# EAGLE design MCP23S17-v2 (EAGLE 9.6.2)
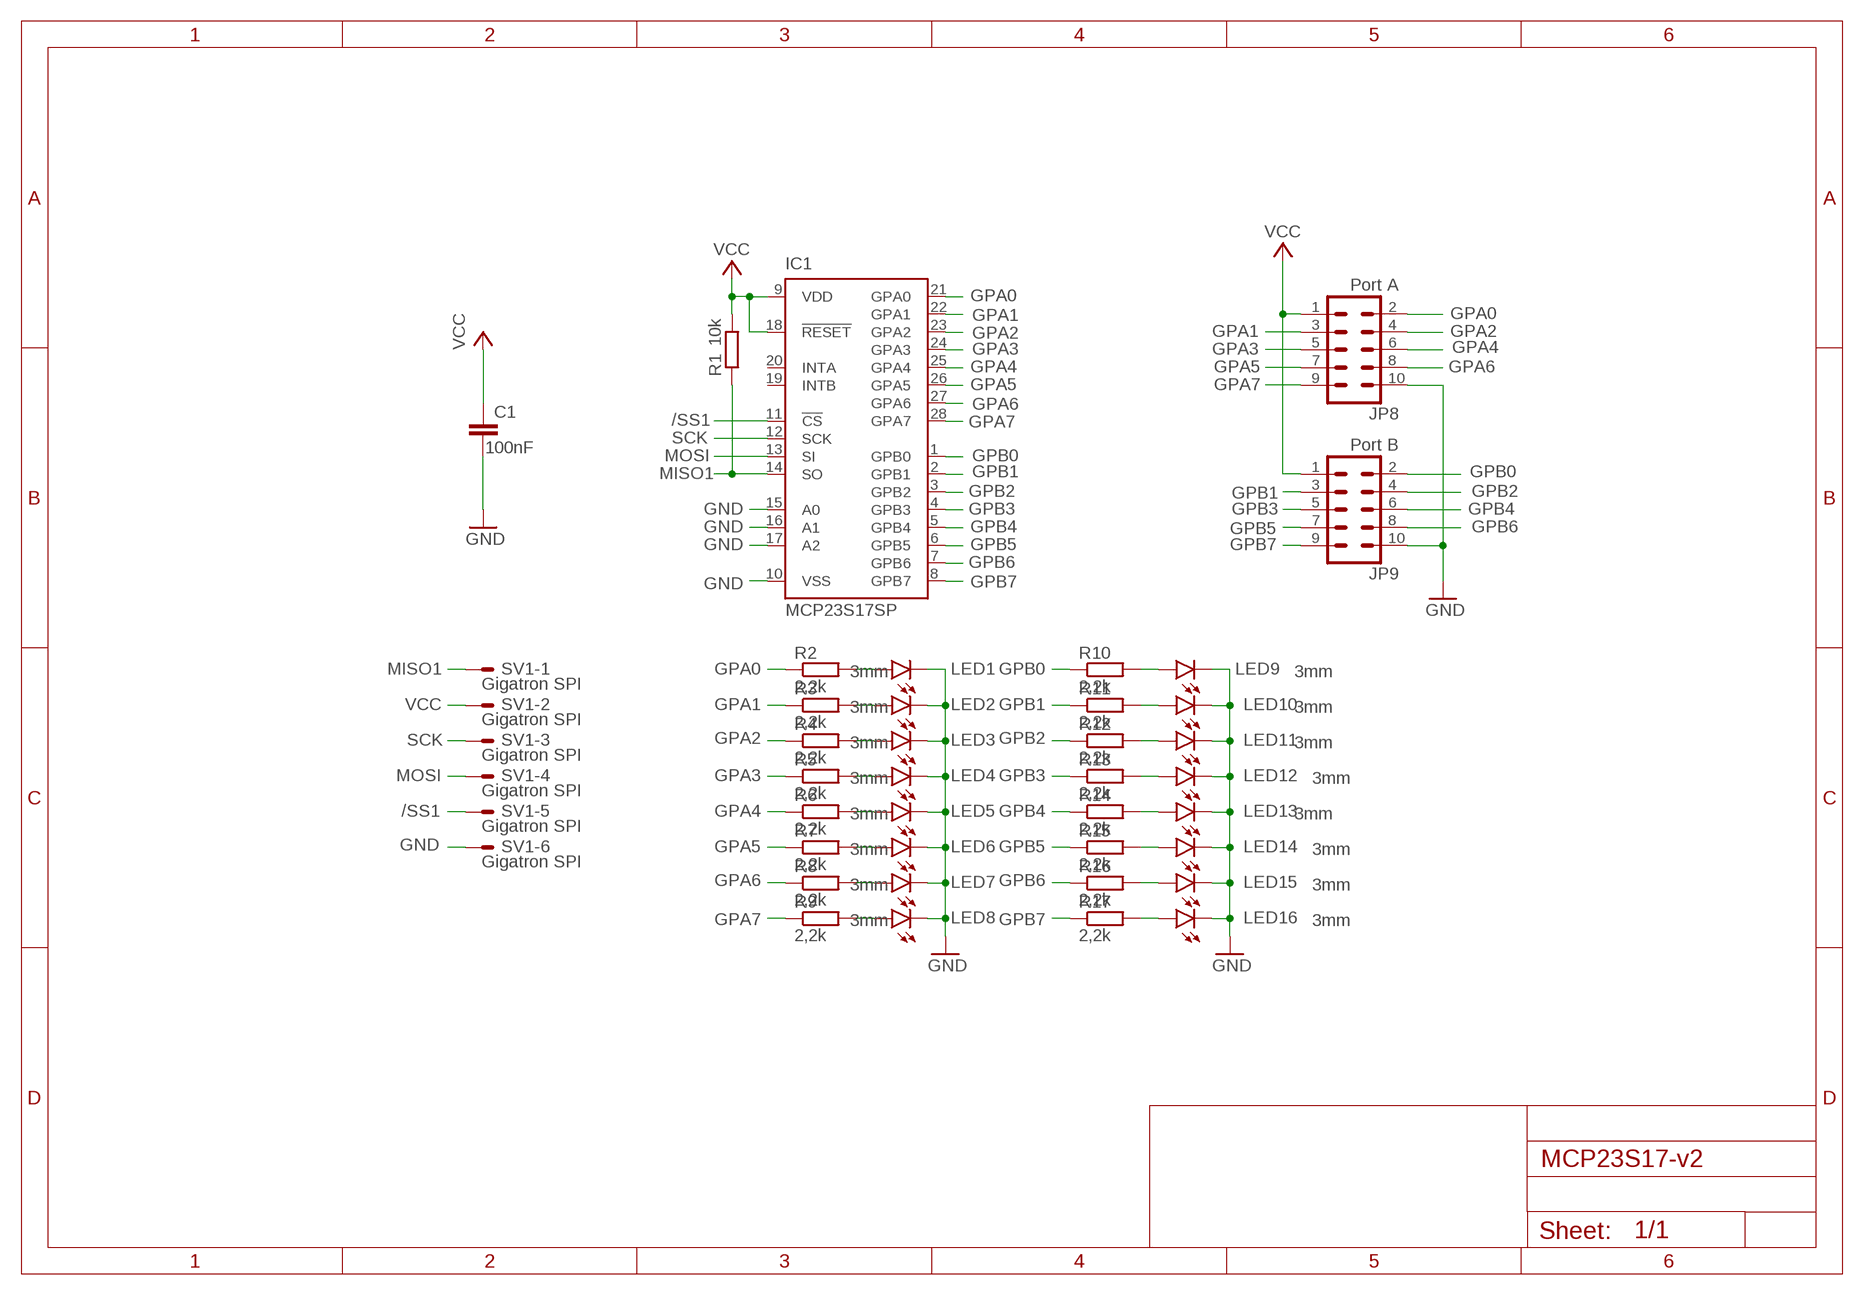
[diagram p0: schematic, sheet 1]

## Parts
C1  100nF  C5/2.5  [C5B2.5]
IC1  MCP23S17SP  [DIL28-3]
JP8  Port A  ML10  [ML10]
JP9  Port B  ML10  [ML10]
LED1  3mm  LED3MM  [LED3MM]
LED2  3mm  LED3MM  [LED3MM]
LED3  3mm  LED3MM  [LED3MM]
LED4  3mm  LED3MM  [LED3MM]
LED5  3mm  LED3MM  [LED3MM]
LED6  3mm  LED3MM  [LED3MM]
LED7  3mm  LED3MM  [LED3MM]
LED8  3mm  LED3MM  [LED3MM]
LED9  3mm  LED3MM  [LED3MM]
LED10  3mm  LED3MM  [LED3MM]
LED11  3mm  LED3MM  [LED3MM]
LED12  3mm  LED3MM  [LED3MM]
LED13  3mm  LED3MM  [LED3MM]
LED14  3mm  LED3MM  [LED3MM]
LED15  3mm  LED3MM  [LED3MM]
LED16  3mm  LED3MM  [LED3MM]
R1  10k  R-EU_0207/10  [0207/10]
R2  2,2k  R-EU_0207/10  [0207/10]
R3  2,2k  R-EU_0207/10  [0207/10]
R4  2,2k  R-EU_0207/10  [0207/10]
R5  2,2k  R-EU_0207/10  [0207/10]
R6  2,2k  R-EU_0207/10  [0207/10]
R7  2,2k  R-EU_0207/10  [0207/10]
R8  2,2k  R-EU_0207/10  [0207/10]
R9  2,2k  R-EU_0207/10  [0207/10]
R10  2,2k  R-EU_0207/10  [0207/10]
R11  2,2k  R-EU_0207/10  [0207/10]
R12  2,2k  R-EU_0207/10  [0207/10]
R13  2,2k  R-EU_0207/10  [0207/10]
R14  2,2k  R-EU_0207/10  [0207/10]
R15  2,2k  R-EU_0207/10  [0207/10]
R16  2,2k  R-EU_0207/10  [0207/10]
R17  2,2k  R-EU_0207/10  [0207/10]
SV1  Gigatron SPI  ML6E  [ML6]

## Nets
/SS1: IC1.11(!CS) SV1.5
GND [power]: C1.2 IC1.10(VSS) IC1.15(A0) IC1.16(A1) IC1.17(A2) JP8.10 JP9.10 LED1.K(C) LED2.K(C) LED3.K(C) LED4.K(C) LED5.K(C) LED6.K(C) LED7.K(C) LED8.K(C) LED9.K(C) LED10.K(C) LED11.K(C) LED12.K(C) LED13.K(C) LED14.K(C) LED15.K(C) LED16.K(C) SV1.6
GPA0: IC1.21(GPA0) JP8.2 R2.1
GPA1: IC1.22(GPA1) JP8.3 R3.1
GPA2: IC1.23(GPA2) JP8.4 R4.1
GPA3: IC1.24(GPA3) JP8.5 R5.1
GPA4: IC1.25(GPA4) JP8.6 R6.1
GPA5: IC1.26(GPA5) JP8.7 R7.1
GPA6: IC1.27(GPA6) JP8.8 R8.1
GPA7: IC1.28(GPA7) JP8.9 R9.1
GPB0: IC1.1(GPB0) JP9.2 R10.1
GPB1: IC1.2(GPB1) JP9.3 R11.1
GPB2: IC1.3(GPB2) JP9.4 R12.1
GPB3: IC1.4(GPB3) JP9.5 R13.1
GPB4: IC1.5(GPB4) JP9.6 R14.1
GPB5: IC1.6(GPB5) JP9.7 R15.1
GPB6: IC1.7(GPB6) JP9.8 R16.1
GPB7: IC1.8(GPB7) JP9.9 R17.1
MISO1: IC1.14(SO) R1.1 SV1.1
MOSI: IC1.13(SI) SV1.4
N$1: LED1.A R2.2
N$2: LED2.A R3.2
N$3: LED3.A R4.2
N$4: LED4.A R5.2
N$5: LED5.A R6.2
N$6: LED6.A R7.2
N$7: LED7.A R8.2
N$8: LED8.A R9.2
N$9: LED9.A R10.2
N$10: LED10.A R11.2
N$11: LED11.A R12.2
N$12: LED12.A R13.2
N$13: LED13.A R14.2
N$14: LED14.A R15.2
N$15: LED15.A R16.2
N$16: LED16.A R17.2
SCK: IC1.12(SCK) SV1.3
VCC [power]: C1.1 IC1.9(VDD) IC1.18(!RESET) JP8.1 JP9.1 R1.2 SV1.2
Unconnected: IC1.19(INTB) IC1.20(INTA)

## Library data of the parts
C1 = capacitor-wima:C: CAPACITOR naming: grid - package width
IC1 = microchip:MCP23S17: http://ww1.microchip.com/downloads/en/DeviceDoc/21952a.pdf Source: http://ww1.microchip.com/downloads/en/DeviceDoc/21952a.pdf; MF: MICROCHIP; MPN: MCP23S17-E/SP; OC_FARNELL: 1292238; OC_NEWARK: 31K2951
JP8 JP9 = con-ml:ML10: HARTING; OC_FARNELL: unknown; OC_NEWARK: unknown
LED1-LED16 = led:LED: LED OSRAM: - CHIPLED LG R971, LG N971, LY N971, LG Q971, LY Q971, LO R971, LY R971 LH N974, LH R974 LS Q976, LO Q976, LY Q976 LO Q996 - Hyper CHIPLED LW Q18S LB Q993, LB Q99A, LB R99A - SideLED LS A670, LO A670, LY A670, LG A670, LP A670 LB A673, LV A673, LT A673, LW A673 LH A674 LY A675 LS A676, LA A676, LO A676, LY A676, LW A676 LS A679, LY A679, LG A679 - Hyper Micro SIDELED® LS Y876, LA Y876, LO Y876, LY Y876 LT Y87S - SmartLED LW L88C, LW L88S LB L89C, LB L89S, LG L890 LS L89K, LO L89K, LY L89K LS L896, LA L896, LO L896, LY L896 - TOPLED LS T670, LO T670, LY T670, LG T670, LP T670 LSG T670, LSP T670, LSY T670, LOP T670, LYG T670 LG T671, LOG T671, LSG T671 LB T673, LV T673, LT T673, LW T673 LH T674 LS T676, LA T676, LO T676, LY T676, LB T676, LH T676, LSB T676, LW T676 LB T67C, LV T67C, LT T67C, LS T67K, LO T67K, LY T67K, LW E67C LS E67B, LA E67B, LO E67B, LY E67B, LB E67C, LV E67C, LT E67C LW T67C LS T679, LY T679, LG T679 LS T770, LO T770, LY T770, LG T770, LP T770 LB T773, LV T773, LT T773, LW T773 LH T774 LS E675, LA E675, LY E675, LS T675 LS T776, LA T776, LO T776, LY T776, LB T776 LHGB T686 LT T68C, LB T68C - Hyper Mini TOPLED® LB M676 - Mini TOPLED Santana® LG M470 LS M47K, LO M47K, LY M47K Source: http://www.osram.convergy.de LUXEON: - LUMILED® LXK2-PW12-R00, LXK2-PW12-S00, LXK2-PW14-U00, LXK2-PW14-V00 LXK2-PM12-R00, LXK2-PM12-S00, LXK2-PM14-U00 LXK2-PE12-Q00, LXK2-PE12-R00, LXK2-PE12-S00, LXK2-PE14-T00, LXK2-PE14-U00 LXK2-PB12-K00, LXK2-PB12-L00, LXK2-PB12-M00, LXK2-PB14-N00, LXK2-PB14-P00, LXK2-PB14-Q00 LXK2-PR12-L00, LXK2-PR12-M00, LXK2-PR14-Q00, LXK2-PR14-R00 LXK2-PD12-Q00, LXK2-PD12-R00, LXK2-PD12-S00 LXK2-PH12-R00, LXK2-PH12-S00 LXK2-PL12-P00, LXK2-PL12-Q00, LXK2-PL12-R00 Source: www.luxeon.com KINGBRIGHT: KA-3528ASYC Source: www.kingbright.com
R1-R17 = rcl:R-EU_: RESISTOR, European symbol; SPICEPREFIX: R
SV1 = con-ml:ML6E: HARTING; OC_FARNELL: unknown; OC_NEWARK: unknown

## Net classes
0 default: width 0.203 mm, drill 0.127 mm, clearance 0.203 mm
1 power: width 0.254 mm, drill 0.127 mm, clearance 0.203 mm

## Board
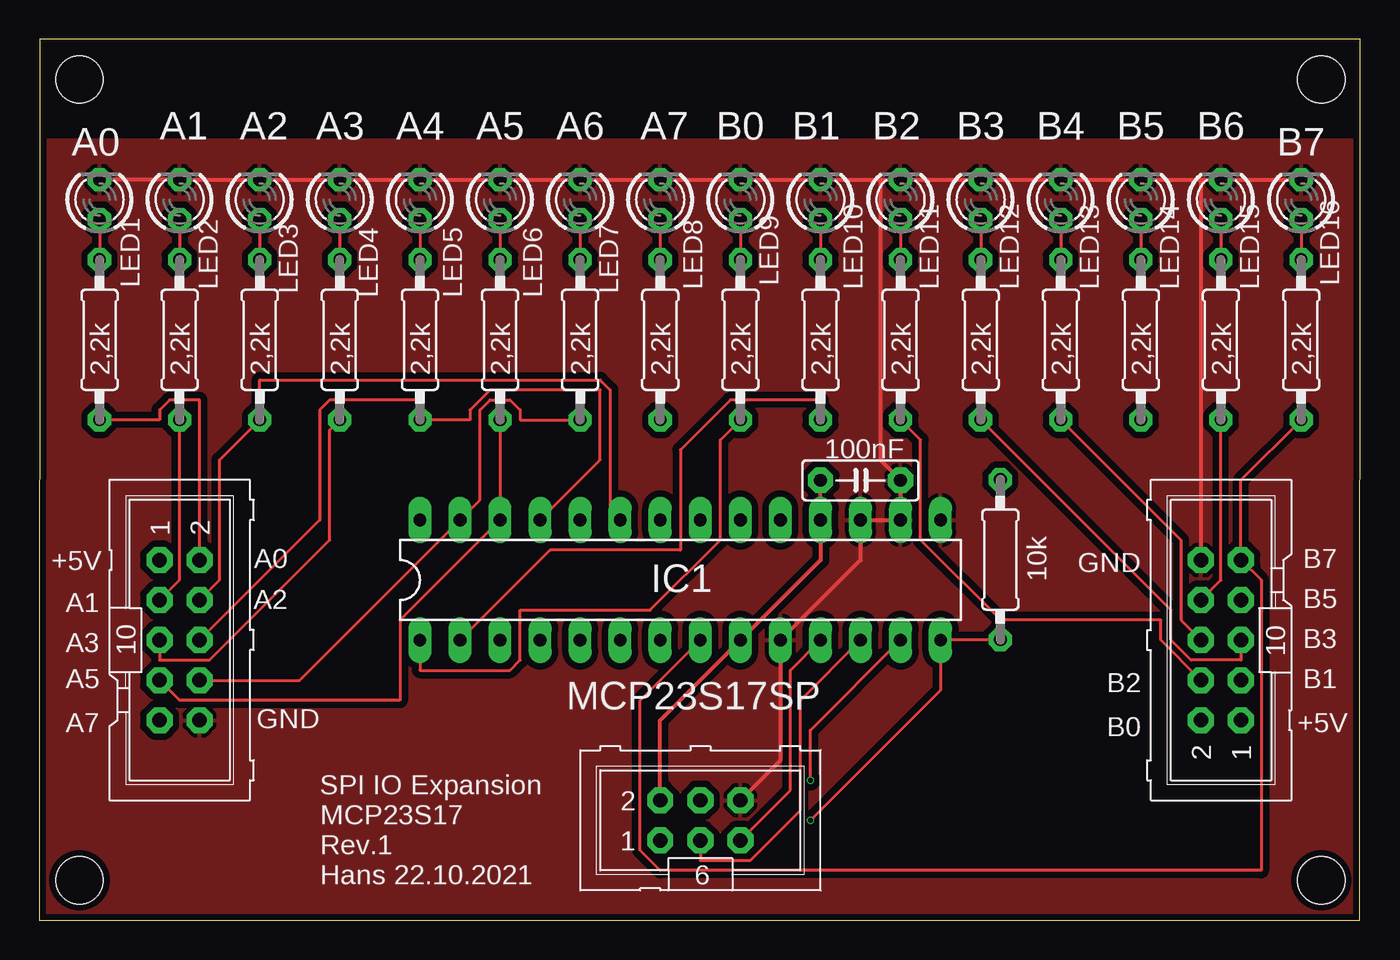
[diagram p1: board, top side]
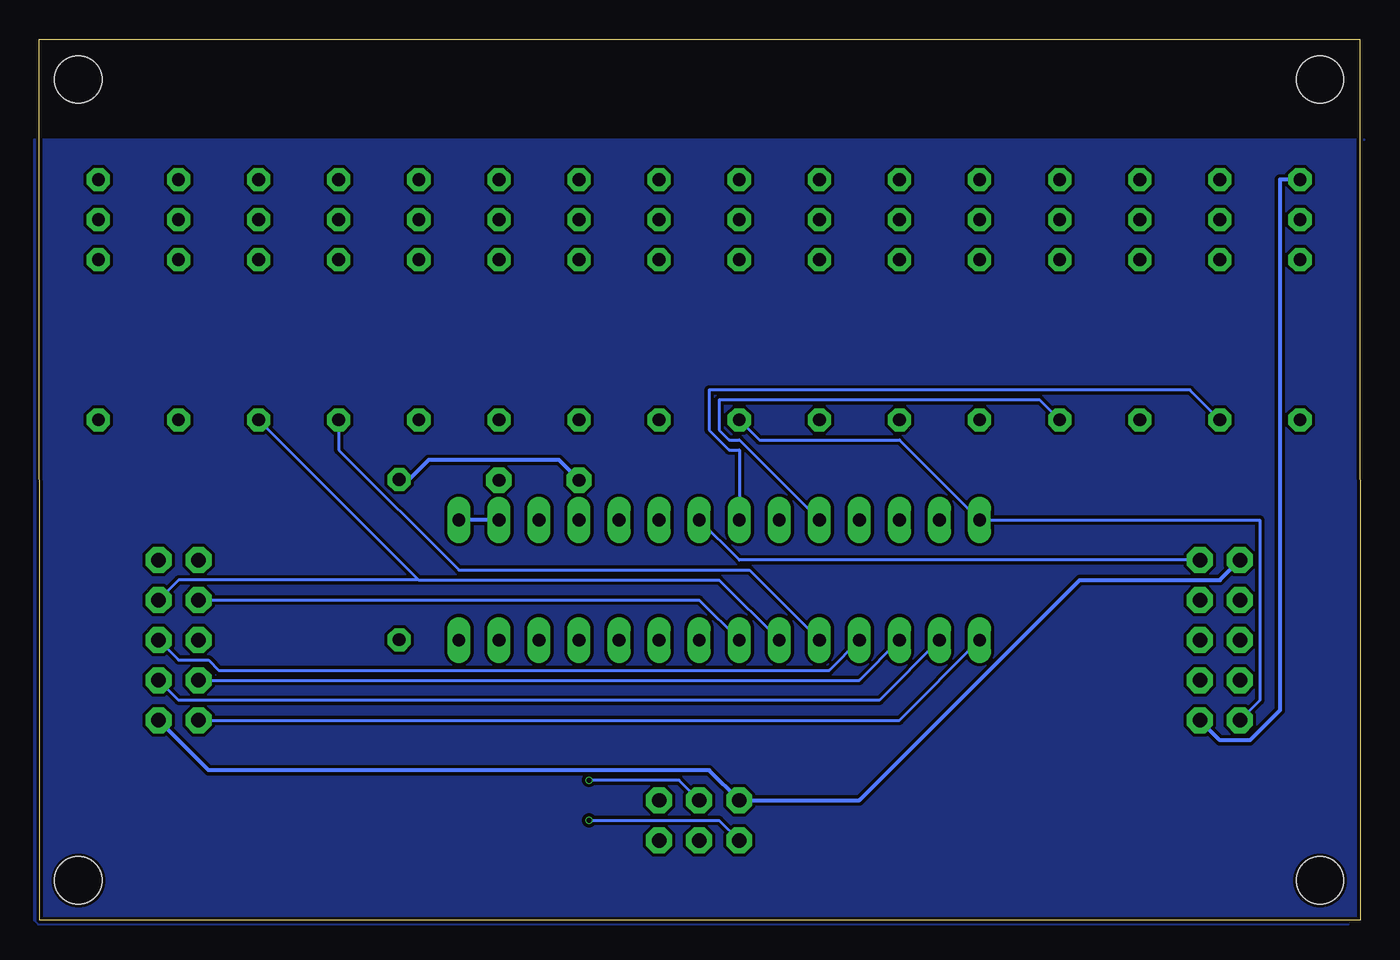
[diagram p2: board, bottom side, seen from below]

Size 83.75 x 55.88 mm. Coordinates in mm from the lower left corner, seen from the top.
Outline: 0,0 83.72,0 83.75,55.88 0.03,55.88 0,0
Copper layers (1*16): Top 0.035mm / dielectric 1.6mm / Bottom 0.035mm
Design rules "jlcpcb-2layers": minimum track width 5mil, minimum drill 0.3mm, track to track 5mil, track to pad 5mil, pad to pad 5mil, via to via 5mil, smd to smd 5mil, copper to edge 0.2mm, drill to drill 6mil, minimum pad ring 10mil, minimum via ring 3mil, stop-mask expansion 4mil, vias tented up to drill 0mil, thermal gap 10mil
Holes 3 mm at 2.54,2.54 81.28,2.54 2.54,53.34 81.28,53.34

### Footprints (pad centres in the part's own frame; a part is rotated, then mirrored left to right if it is on the bottom)
C5B2.5 = drill 0.813 pad 1.6 octagon: 1 -2.54,0; 2 2.54,0
DIL28-3 = drill 0.813 long: 1 -16.51,-3.81; 2 -13.97,-3.81; 3 -11.43,-3.81; 4 -8.89,-3.81; 5 -6.35,-3.81; 6 -3.81,-3.81; 7 -1.27,-3.81; 8 1.27,-3.81; 9 3.81,-3.81; 10 6.35,-3.81; 11 8.89,-3.81; 12 11.43,-3.81; 13 13.97,-3.81; 14 16.51,-3.81; 15 16.51,3.81; 16 13.97,3.81; 17 11.43,3.81; 18 8.89,3.81; 19 6.35,3.81; 20 3.81,3.81; 21 1.27,3.81; 22 -1.27,3.81; 23 -3.81,3.81; 24 -6.35,3.81; 25 -8.89,3.81; 26 -11.43,3.81; 27 -13.97,3.81; 28 -16.51,3.81
ML10 = drill 0.914 octagon: 1 -5.08,-1.27; 2 -5.08,1.27; 3 -2.54,-1.27; 4 -2.54,1.27; 5 0,-1.27; 6 0,1.27; 7 2.54,-1.27; 8 2.54,1.27; 9 5.08,-1.27; 10 5.08,1.27
LED3MM = drill 0.813 octagon: A -1.27,0; K 1.27,0
0207/10 = drill 0.813 octagon: 1 -5.08,0; 2 5.08,0
ML6 = drill 0.914 octagon: 1 -2.54,-1.27; 2 -2.54,1.27; 3 0,-1.27; 4 0,1.27; 5 2.54,-1.27; 6 2.54,1.27

### Placement (x,y rotation side)
C1  52.07,27.91 0 top
IC1  40.64,21.59 0 top
JP8  8.89,17.78 270 top
JP9  74.93,17.78 90 top
LED1  3.81,45.72 90 top
LED2  8.89,45.72 90 top
LED3  13.97,45.72 90 top
LED4  19.05,45.72 90 top
LED5  24.13,45.72 90 top
LED6  29.21,45.72 90 top
LED7  34.29,45.72 90 top
LED8  39.37,45.72 90 top
LED9  44.45,45.72 90 top
LED10  49.53,45.72 90 top
LED11  54.61,45.72 90 top
LED12  59.69,45.72 90 top
LED13  64.77,45.72 90 top
LED14  69.85,45.72 90 top
LED15  74.93,45.72 90 top
LED16  80.01,45.72 90 top
R1  60.93,22.89 90 top
R2  3.81,36.83 90 top
R3  8.89,36.83 90 top
R4  13.97,36.83 90 top
R5  19.05,36.83 90 top
R6  24.13,36.83 90 top
R7  29.21,36.83 90 top
R8  34.29,36.83 90 top
R9  39.37,36.83 90 top
R10  44.45,36.83 90 top
R11  49.53,36.83 90 top
R12  54.61,36.83 90 top
R13  59.69,36.83 90 top
R14  64.77,36.83 90 top
R15  69.85,36.83 90 top
R16  74.93,36.83 90 top
R17  80.01,36.83 90 top
SV1  41.91,6.35 0 top

### Tracks (layer width: path | path; a pad name or v marks a point on that pad's centre or on a via)
/SS1
  Top 0.203: IC1.11 47.62,15.88 47.62,8.26 SV1.5
GND
  Top 0.254: SV1.6 46.99,10.16 IC1.10 52.07,22.86 IC1.17 IC1.16 C1.2 54.61,27.94 53.34,29.21 53.34,46.99 | LED1.K LED2.K LED3.K LED4.K LED5.K LED6.K LED7.K LED8.K LED9.K LED10.K 53.34,46.99 | 53.34,46.99 LED11.K LED12.K LED13.K LED14.K 73.66,46.99 | 73.66,46.99 LED15.K LED16.K | 73.66,46.99 JP9.10
  Bottom 0.254: IC1.16 IC1.15 | JP8.10 8.89,11.43 6.99,11.43 5.08,13.34 5.08,46.99 LED1.K
  pour Top (isolate 0.406): 0.51,0 0.25,-0.25 0.25,49.53 84.07,49.53 83.82,0
GPA0
  Top 0.203: R2.1 7.62,31.75 7.62,32.38 8.26,33.02 10.16,33.02 JP8.2
  Bottom 0.203: IC1.21 39.37,22.86 JP8.2
GPA1
  Top 0.203: R3.1 8.89,21.59 JP8.3
  Bottom 0.203: IC1.22 39.37,29.84 40.01,29.84 41.27,31.11 41.27,33.66 10.79,33.66 R3.1
GPA2
  Top 0.203: JP8.4 11.43,21.59 11.43,29.21 R4.1 13.97,34.29 35.56,34.29 36.2,33.66 36.2,26.04 IC1.23
GPA3
  Top 0.203: R5.1 18.41,31.11 18.41,24.13 10.79,16.51 7.62,16.51 JP8.5
  Bottom 0.203: IC1.24 39.37,30.48 40.01,30.48 40.64,31.11 40.64,33.02 20.32,33.02 R5.1
GPA4
  Top 0.203: IC1.25 35.56,29.21 35.56,33.66 28.57,33.66 27.3,32.38 27.3,31.75 R6.1 24.13,33.02 18.41,33.02 17.78,32.38 17.78,25.4 JP8.6
GPA5
  Top 0.203: R7.1 IC1.26 22.86,19.05 22.86,13.97 8.89,13.97 JP8.7
GPA6
  Top 0.203: JP8.8 16.51,15.24 IC1.27 27.94,26.67 27.94,32.38 28.57,33.02 29.84,33.02 30.48,32.38 30.48,31.75 R8.1
GPA7
  Bottom 0.203: R9.1 38.1,30.48 29.21,30.48 IC1.28 6.35,25.4 6.35,13.97 JP8.9
GPB0
  Top 0.203: R10.1 43.18,30.48 43.18,24.13 38.73,19.68 30.48,19.68 30.48,16.51 29.84,15.88 24.13,15.88 IC1.1
  Bottom 0.203: IC1.1 29.21,12.7 JP9.2
GPB1
  Top 0.203: IC1.2 32.38,23.5 40.64,23.5 40.64,29.84 43.81,33.02 49.53,33.02 R11.1
  Bottom 0.203: JP9.3 74.93,13.97 30.48,13.97 IC1.2
GPB2
  Top 0.203: R12.1 55.88,30.48 55.88,24.13 60.96,19.05 71.12,19.05 71.12,17.78 JP9.4
  Bottom 0.203: IC1.3 31.75,15.24 JP9.4
GPB3
  Top 0.203: R13.1 71.75,19.68 71.75,17.78 73.03,16.51 76.2,16.51 JP9.5
  Bottom 0.203: IC1.4 33.66,15.88 72.39,15.88 73.03,16.51 74.93,16.51 JP9.5
GPB4
  Top 0.203: JP9.6 72.39,19.05 72.39,24.13 R14.1
  Bottom 0.203: IC1.5 38.73,22.23 57.15,22.23 64.77,29.84 R14.1
GPB5
  Bottom 0.203: IC1.6 40.64,21.59 59.69,21.59 | R15.1 59.69,21.59 | JP9.7 74.93,21.59 59.69,21.59
GPB6
  Top 0.203: R16.1 74.93,21.59 JP9.8
  Bottom 0.203: IC1.7 41.91,20.32 JP9.8
GPB7
  Top 0.203: IC1.8 38.1,13.97 38.1,4.45 39.37,3.17 77.47,3.17 77.47,21.59 JP9.9 76.2,27.94 R17.1
MISO1  (via drill 0.3)
  Top 0.203: R1.1 60.33,17.78 IC1.14 57.15,14.61 v48.9,6.35
  Bottom 0.203: SV1.1 40.64,6.35 v48.9,6.35
MOSI  (via drill 0.3)
  Top 0.203: IC1.13 48.9,12.06 v48.9,8.89
  Bottom 0.203: v48.9,8.89 43.18,8.89 SV1.4
N$1
  Top 0.203: LED1.A R2.2
N$2
  Top 0.203: LED2.A R3.2
N$3
  Top 0.203: LED3.A R4.2
N$4
  Top 0.203: LED4.A R5.2
N$5
  Top 0.203: LED5.A R6.2
N$6
  Top 0.203: LED6.A R7.2
N$7
  Top 0.203: LED7.A R8.2
N$8
  Top 0.203: LED8.A R9.2
N$9
  Top 0.203: LED9.A R10.2
N$10
  Top 0.203: LED10.A R11.2
N$11
  Top 0.203: LED11.A R12.2
N$12
  Top 0.203: LED12.A R13.2
N$13
  Top 0.203: LED13.A R14.2
N$14
  Top 0.203: LED14.A R15.2
N$15
  Top 0.203: LED15.A R16.2
N$16
  Top 0.203: LED16.A R17.2
N$17
  pour Bottom: 83.82,-0.25 0.76,-0.25 0.25,0.25 0.25,49.02 -0.25,49.53 84.07,49.53 84.07,0
SCK
  Top 0.203: IC1.12 48.26,13.97 48.26,6.99 45.09,3.81 41.91,3.81 SV1.3
VCC
  Top 0.254: C1.1 IC1.18 49.53,22.86 IC1.9 39.37,12.7 SV1.2
  Bottom 0.254: R1.2 60.33,27.94 59.05,29.21 50.8,29.21 49.53,27.94 C1.1 | JP8.1 8.89,21.59 17.78,21.59 31.75,7.62 SV1.2 41.27,9.53 73.03,9.53 JP9.1

### Text on the board
tPlace: A1 | A2 | A3 | A4 | A5 | A6 | A7 | B0 | B1 | B2 | B3 | B4 | B5 | B6 | A0 | B7 | A0 | B7 | +5V | GND | A1 | A2 | B5 | B3 | A3 | A5 | B2 | B1 | A7 | GND | B0 | +5V | SPI IO Expansion / MCP23S17 / Rev.1 / Hans 22.10.2021